# EAGLE schematic mcu_v2.0_sch (EAGLE 9.4.2)
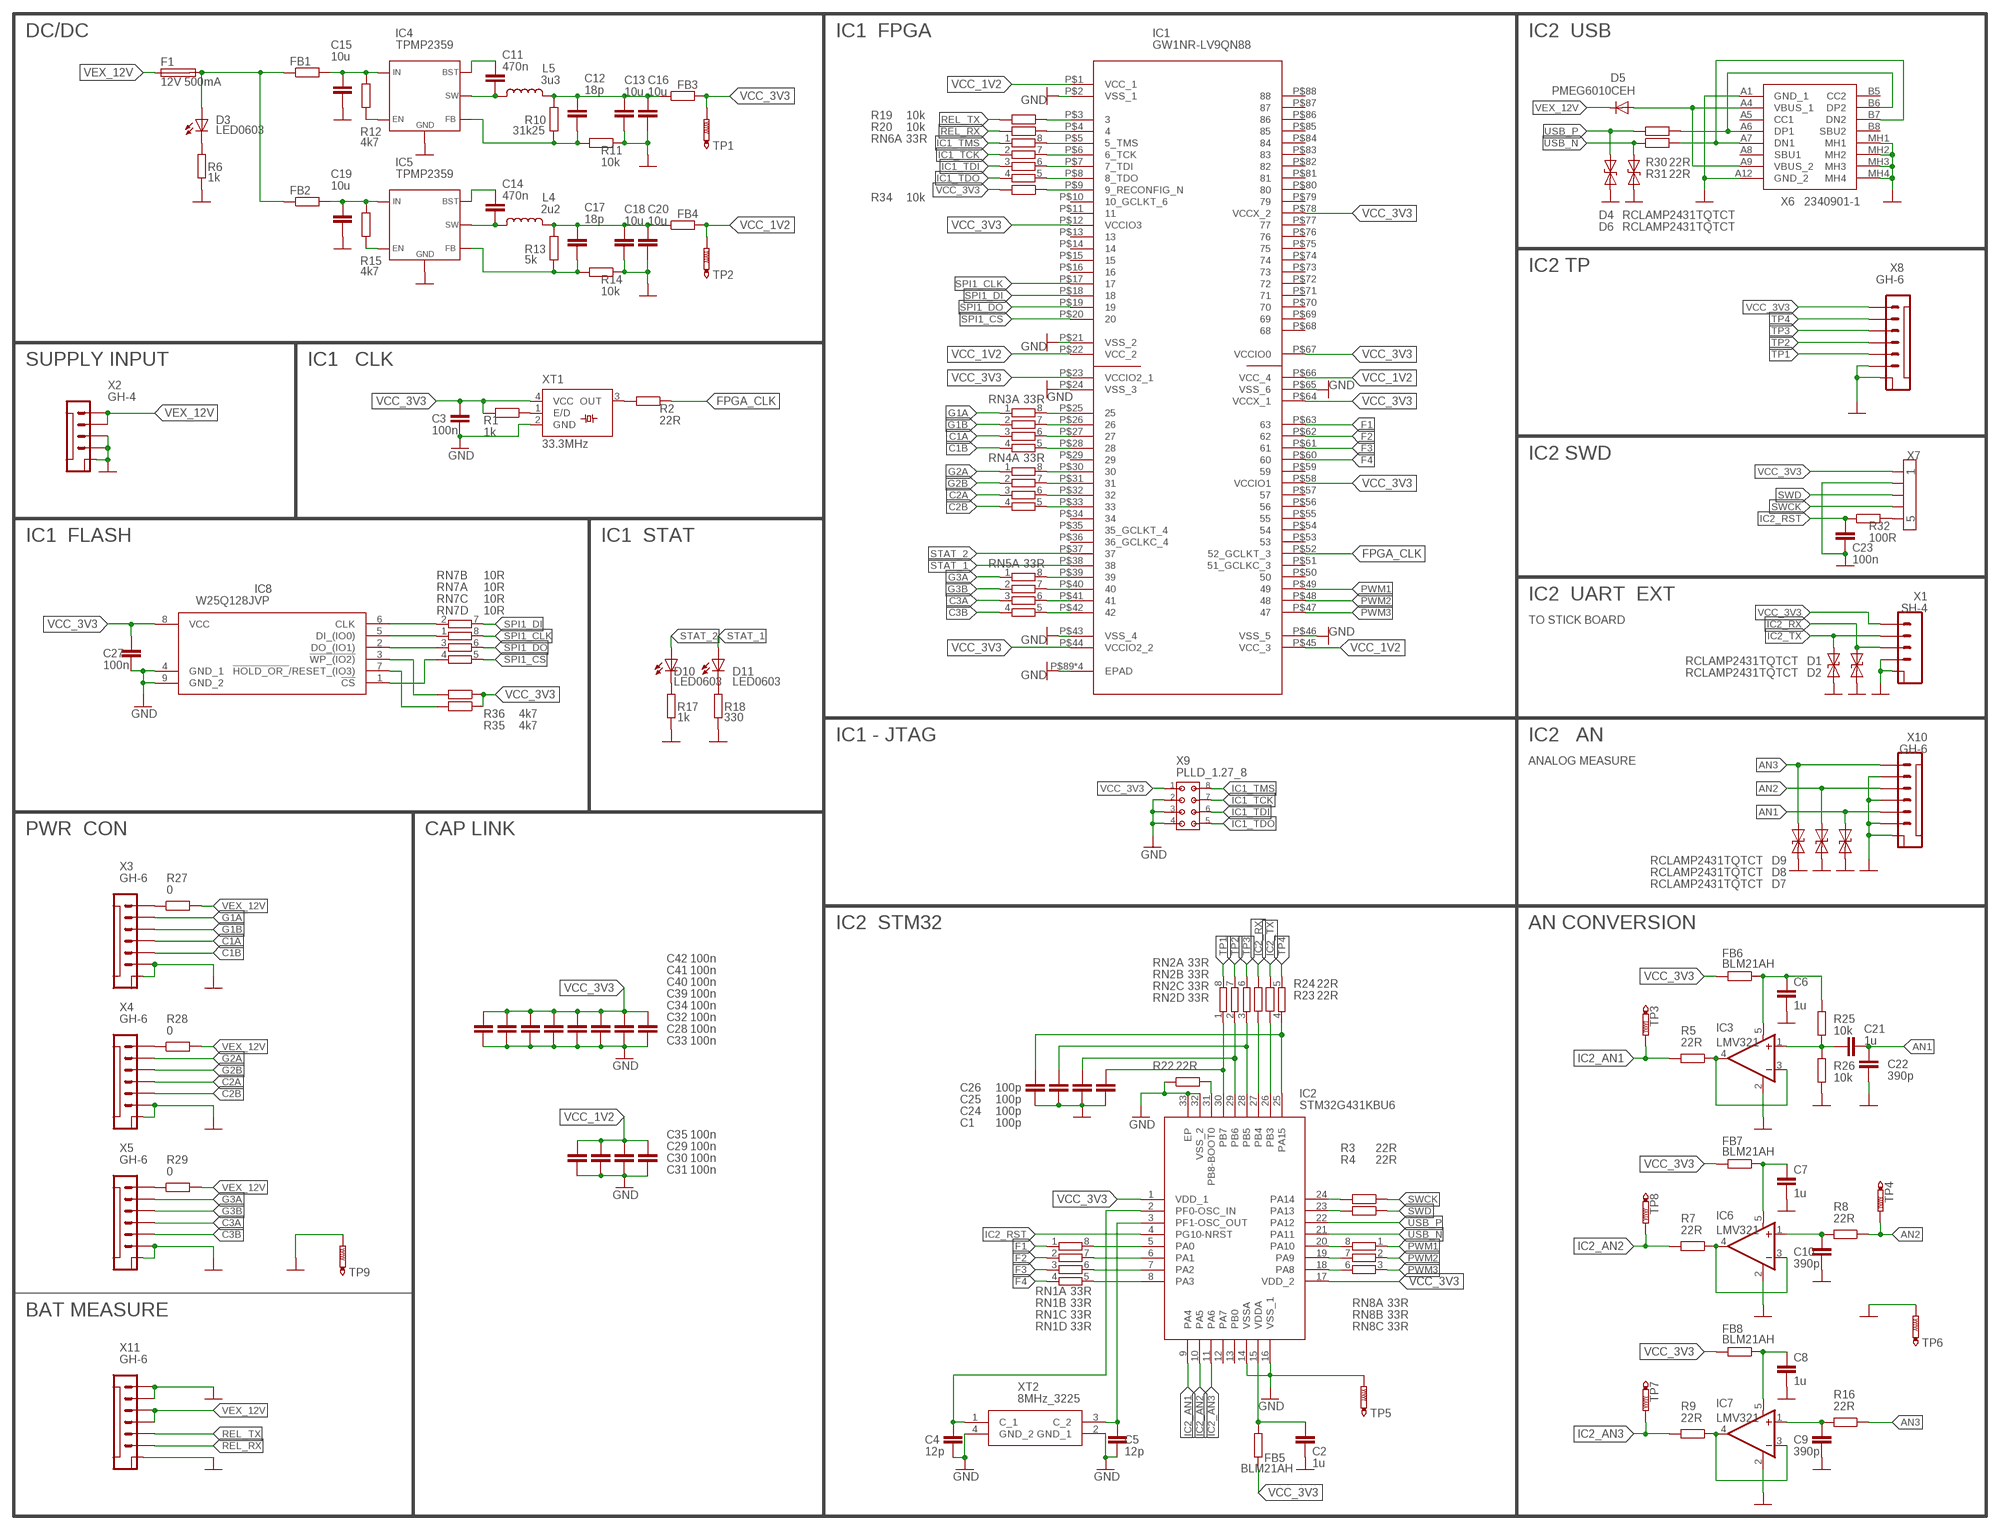
[diagram p0: schematic, sheet 1]

## Parts
C1  100p  C-EUC0402  [C0402]
C2  1u  C-EUC0603  [C0603]
C3  100n  C-EUC0603  [C0603]
C4  12p  C-EUC0603  [C0603]
C5  12p  C-EUC0603  [C0603]
C6  1u  C-EUC0603  [C0603]
C7  1u  C-EUC0603  [C0603]
C8  1u  C-EUC0603  [C0603]
C9  390p  C-EUC0603  [C0603]
C10  390p  C-EUC0603  [C0603]
C11  470n  C-EUC0603  [C0603]
C12  18p  C-EUC0603  [C0603]
C13  10u  C-EUC0805  [C0805]
C14  470n  C-EUC0603  [C0603]
C15  10u  C-EUC0805  [C0805]
C16  10u  C-EUC0805  [C0805]
C17  18p  C-EUC0603  [C0603]
C18  10u  C-EUC0805  [C0805]
C19  10u  C-EUC0805  [C0805]
C20  10u  C-EUC0805  [C0805]
C21  1u  C-EUC0603  [C0603]
C22  390p  C-EUC0603  [C0603]
C23  100n  C-EUC0402  [C0402]
C24  100p  C-EUC0402  [C0402]
C25  100p  C-EUC0402  [C0402]
C26  100p  C-EUC0402  [C0402]
C27  100n  C-EUC0603  [C0603]
C28  100n  C-EUC0603  [C0603]
C29  100n  C-EUC0603  [C0603]
C30  100n  C-EUC0603  [C0603]
C31  100n  C-EUC0603  [C0603]
C32  100n  C-EUC0603  [C0603]
C33  100n  C-EUC0603  [C0603]
C34  100n  C-EUC0603  [C0603]
C35  100n  C-EUC0603  [C0603]
C39  100n  C-EUC0603  [C0603]
C40  100n  C-EUC0603  [C0603]
C41  100n  C-EUC0603  [C0603]
C42  100n  C-EUC0603  [C0603]
D1  RCLAMP2431TQTCT  [RCLAMP2431TQTCT]
D2  RCLAMP2431TQTCT  [RCLAMP2431TQTCT]
D3  LED0603  [SML0603]
D4  RCLAMP2431TQTCT  [RCLAMP2431TQTCT]
D5  PMEG6010CEH  [SOD123]
D6  RCLAMP2431TQTCT  [RCLAMP2431TQTCT]
D7  RCLAMP2431TQTCT  [RCLAMP2431TQTCT]
D8  RCLAMP2431TQTCT  [RCLAMP2431TQTCT]
D9  RCLAMP2431TQTCT  [RCLAMP2431TQTCT]
D10  LED0603  [SML0603]
D11  LED0603  [SML0603]
F1  12V 500mA  MF-MSMF  [MF-MSMF050]
FB1  R-EU_R0805  [R0805]
FB2  R-EU_R0805  [R0805]
FB3  R-EU_R0805  [R0805]
FB4  R-EU_R0805  [R0805]
FB5  BLM21AH  R-EU_R0805  [R0805]
FB6  BLM21AH  R-EU_R0805  [R0805]
FB7  BLM21AH  R-EU_R0805  [R0805]
FB8  BLM21AH  R-EU_R0805  [R0805]
IC1  GW1NR-LV9QN88  [QFN88]
IC2  STM32G431KBU6  [QFN50P500X500X60-33N]
IC3  LMV321  [SOT23-5]
IC4  TPMP2359  MP2359  [SOT-23-6]
IC5  TPMP2359  MP2359  [SOT-23-6]
IC6  LMV321  [SOT23-5]
IC7  LMV321  [SOT23-5]
IC8  W25Q128JVP  W25Q128JVPIQWSON-8(5X6)  [WSON-8(5X6)]
L4  2u2  SRN3015  [SRN3015]
L5  3u3  SRN3015  [SRN3015]
R1  1k  R-EU_R0603  [R0603]
R2  22R  R-EU_R0603  [R0603]
R3  22R  R-EU_R0402  [R0402]
R4  22R  R-EU_R0402  [R0402]
R5  22R  R-EU_R0603  [R0603]
R6  1k  R-EU_R0603  [R0603]
R7  22R  R-EU_R0603  [R0603]
R8  22R  R-EU_R0603  [R0603]
R9  22R  R-EU_R0603  [R0603]
R10  31k25  R-EU_R0603  [R0603]
R11  10k  R-EU_R0402  [R0402]
R12  4k7  R-EU_R0402  [R0402]
R13  5k  R-EU_R0603  [R0603]
R14  10k  R-EU_R0402  [R0402]
R15  4k7  R-EU_R0402  [R0402]
R16  22R  R-EU_R0603  [R0603]
R17  1k  R-EU_R0603  [R0603]
R18  330  R-EU_R0603  [R0603]
R19  10k  R-EU_R0402  [R0402]
R20  10k  R-EU_R0402  [R0402]
R22  22R  R-EU_R0402  [R0402]
R23  22R  R-EU_R0603  [R0603]
R24  22R  R-EU_R0603  [R0603]
R25  10k  R-EU_R0603  [R0603]
R26  10k  R-EU_R0603  [R0603]
R27  0  R-EU_R1206  [R1206]
R28  0  R-EU_R1206  [R1206]
R29  0  R-EU_R1206  [R1206]
R30  22R  R-EU_R0603  [R0603]
R31  22R  R-EU_R0603  [R0603]
R32  100R  R-EU_R0402  [R0402]
R34  10k  R-EU_R0603  [R0603]
R35  4k7  R-EU_R0603  [R0603]
R36  4k7  R-EU_R0603  [R0603]
RN1  33R  4R-N0603-ARC  [0603-ARC]
RN2  33R  4R-N0603-ARC  [0603-ARC]
RN3  33R  4R-N0603-ARC  [0603-ARC]
RN4  33R  4R-N0603-ARC  [0603-ARC]
RN5  33R  4R-N0603-ARC  [0603-ARC]
RN6  33R  4R-N0603-ARC  [0603-ARC]
RN7  10R  4R-N0603-ARC  [0603-ARC]
RN8  33R  4R-N0603-ARC  [0603-ARC]
TP1  PTR1B1,27  [B1,27]
TP2  PTR1B1,27  [B1,27]
TP3  PTR1B1,27  [B1,27]
TP4  PTR1B1,27  [B1,27]
TP5  PTR1B1,27  [B1,27]
TP6  PTR1B1,27  [B1,27]
TP7  PTR1B1,27  [B1,27]
TP8  PTR1B1,27  [B1,27]
TP9  PTR1B1,27  [B1,27]
X1  SH-4  [SH-4]
X2  GH-4  [GH-4-H]
X3  GH-6  [GH-6]
X4  GH-6  [GH-6]
X5  GH-6  [GH-6]
X6  2340901-1  [23409011]
X7  PIN_HEADER_1.27_5  [PIN_HEADER_1.27_5]
X8  GH-6  [GH-6]
X9  PLLD_1.27_8  [PLD_1.27_8]
X10  GH-6  [GH-6]
X11  GH-6  [GH-6]
XT1  33.3MHz  LFXTAL  [3.2X2.5MM]
XT2  8MHz_3225  CRYSTAL_3225  [3.2X2.5MM]

## Nets
1: C6.1 FB6.1 IC3.5(V+) R25.1
2: C7.1 FB7.1 IC6.5(V+)
3: C8.1 FB8.1 IC7.5(V+)
AN1: C21.2 C22.1 D7.1(A) X10.P$5
AN2: D8.1(A) R8.1 TP4.TP X10.P$3
AN3: D9.1(A) R16.1 X10.P$1
C1A: RN3.3 X3.P$4
C1B: RN3.4 X3.P$5
C2A: RN4.3 X4.P$4
C2B: RN4.4 X4.P$5
C3A: RN5.3 X5.P$4
C3B: RN5.4 X5.P$5
F1: IC1.P$63 RN1.1
F2: IC1.P$62 RN1.2
F3: IC1.P$61 RN1.3
F4: IC1.P$60 RN1.4
FPGA_CLK: IC1.P$52(52_GCLKT_3) R2.1
G1A: RN3.1 X3.P$2
G1B: RN3.2 X3.P$3
G2A: RN4.1 X4.P$2
G2B: RN4.2 X4.P$3
G3A: RN5.1 X5.P$2
G3B: RN5.2 X5.P$3
GND: C1.1 C2.2 C3.2 C4.2 C5.2 C6.2 C7.2 C8.2 C9.2 C10.2 C13.2 C15.2 C16.2 C18.2 C19.2 C20.2 C22.2 C23.1 C24.1 C25.1 C26.1 C27.2 C28.2 C29.2 C30.2 C31.2 C32.2 C33.2 C34.2 C35.2 C39.2 C40.2 C41.2 C42.2 D1.2(A1) D2.2(A1) D4.2(A1) D6.2(A1) D7.2(A1) D8.2(A1) D9.2(A1) IC1.P$2(VSS_1) IC1.P$21(VSS_2) IC1.P$24(VSS_3) IC1.P$43(VSS_4) IC1.P$46(VSS_5) IC1.P$65(VSS_6) IC1.P$89(EPAD) IC1.P$90(EPAD) IC1.P$91(EPAD) IC1.P$92(EPAD) IC2.14(VSSA) IC2.16(VSS_1) IC2.32(VSS_2) IC2.33(EP) IC3.2(V-) IC4.2(GND) IC5.2(GND) IC6.2(V-) IC7.2(V-) IC8.4(GND_1) IC8.9(GND_2) R6.1 R11.1 R14.1 R17.1 R18.1 R22.1 R26.2 TP5.TP TP6.TP TP9.TP X1.G1(G) X1.G2(G) X1.P$4 X2.3 X2.4 X2.P$7(G) X2.P$8(G) X3.P$6 X3.P$7(G) X3.P$8(G) X4.P$6 X4.P$7(G) X4.P$8(G) X5.P$6 X5.P$7(G) X5.P$8(G) X6.A1(GND_1) X6.A12(GND_2) X6.MH1 X6.MH2 X6.MH3 X6.MH4 X7.P$2 X8.P$6 X8.P$7(G) X8.P$8(G) X9.1 X9.7 X9.8 X10.P$2 X10.P$4 X10.P$6 X10.P$7(G) X10.P$8(G) X11.P$1 X11.P$2 X11.P$7(G) X11.P$8(G) XT1.2(GND) XT2.2(GND_1) XT2.4(GND_2)
IC1_TCK: RN6.2 X9.4
IC1_TDI: RN6.3 X9.3
IC1_TDO: RN6.4 X9.6
IC1_TMS: RN6.1 X9.5
IC2_AN1: IC2.9(PA4) R5.2 TP3.TP
IC2_AN2: IC2.10(PA5) R7.2 TP8.TP
IC2_AN3: IC2.11(PA6) R9.2 TP7.TP
IC2_RST: C23.2 IC2.4(PG10-NRST) R32.1
IC2_RX: D1.1(A) R24.2 X1.P$3
IC2_TX: D2.1(A) R23.2 X1.P$2
N$1: C2.1 FB5.2 IC2.15(VDDA)
N$2: R1.1 XT1.1(E/D)
N$3: R2.2 XT1.3(OUT)
N$4: C11.1 IC4.1(BST)
N$5: C4.1 IC2.2(PF0-OSC_IN) XT2.1(C_1)
N$6: C5.1 IC2.3(PF1-OSC_OUT) XT2.3(C_2)
N$7: IC2.24(PA14) R3.2
N$8: C11.2 IC4.6(SW) L5.P$1
N$9: IC2.23(PA13) R4.2
N$10: IC2.8(PA3) RN1.5
N$11: C14.1 IC5.1(BST)
N$12: IC2.7(PA2) RN1.6
N$13: IC4.4(EN) R12.1
N$14: C12.2 IC4.3(FB) R10.1 R11.2
N$15: C15.1 FB1.2 IC4.5(IN) R12.2
N$16: C14.2 IC5.6(SW) L4.P$1
N$17: C17.2 IC5.3(FB) R13.1 R14.2
N$18: IC5.4(EN) R15.1
N$19: C19.1 FB2.2 IC5.5(IN) R15.2
N$20: C12.1 C13.1 C16.1 FB3.1 L5.P$2 R10.2
N$21: C17.1 C18.1 C20.1 FB4.1 L4.P$2 R13.2
N$22: IC2.6(PA1) RN1.7
N$23: IC2.5(PA0) RN1.8
N$24: IC3.3(-IN) IC3.4(OUT) R5.1
N$25: C21.1 IC3.1(+IN) R25.2 R26.1
N$26: IC6.3(-IN) IC6.4(OUT) R7.1
N$27: C10.1 IC6.1(+IN) R8.2
N$28: IC7.3(-IN) IC7.4(OUT) R9.1
N$29: C9.1 IC7.1(+IN) R16.2
N$30: IC8.6(CLK) RN7.2
N$31: IC8.5(DI_(IO0)) RN7.1
N$32: IC2.20(PA10) RN8.8
N$33: IC2.19(PA9) RN8.7
N$34: IC2.18(PA8) RN8.6
N$35: IC2.31(PB8-BOOT0) R22.2
N$36: IC2.27(PB4) R24.1
N$37: IC2.26(PB3) R23.1
N$38: C1.2 IC2.30(PB7) RN2.1
N$39: C24.2 IC2.29(PB6) RN2.2
N$40: C25.2 IC2.28(PB5) RN2.3
N$41: D3.C R6.2
N$42: IC1.P$25 RN3.8
N$43: IC1.P$26 RN3.7
N$44: IC1.P$27 RN3.6
N$45: IC1.P$28 RN3.5
N$46: IC1.P$30 RN4.8
N$47: IC1.P$31 RN4.7
N$48: IC1.P$32 RN4.6
N$49: IC1.P$33 RN4.5
N$50: IC1.P$39 RN5.8
N$51: IC1.P$40 RN5.7
N$52: IC1.P$41 RN5.6
N$53: IC1.P$42 RN5.5
N$54: R27.1 X3.P$1
N$55: R32.2 X7.P$5
N$56: D5.A X6.A4(VBUS_1) X6.A9(VBUS_2)
N$57: IC1.P$3 R19.1
N$58: R30.2 X6.A6(DP1) X6.B6(DP2)
N$59: R28.1 X4.P$1
N$60: R31.2 X6.A7(DN1) X6.B7(DN2)
N$61: C26.2 IC2.25(PA15) RN2.4
N$62: IC1.P$5(5_TMS) RN6.8
N$63: IC1.P$6(6_TCK) RN6.7
N$64: R29.1 X5.P$1
N$65: IC1.P$7(7_TDI) RN6.6
N$66: IC1.P$8(8_TDO) RN6.5
N$67: IC1.P$9(9_RECONFIG_N) R34.1
N$68: D10.C R17.2
N$69: D11.C R18.2
N$70: IC8.2(DO_(IO1)) RN7.3
N$71: IC8.1(!CS) RN7.4
N$72: IC8.7(!HOLD_OR_!/RESET_(IO3)) R36.2
N$73: IC8.3(!WP_(IO2)) R35.2
N$74: IC1.P$4 R20.1
PWM1: IC1.P$49 RN8.1
PWM2: IC1.P$48 RN8.2
PWM3: IC1.P$47 RN8.3
REL_RX: R20.2 X11.P$6
REL_TX: R19.2 X11.P$5
SPI1_CLK: IC1.P$17 RN7.8
SPI1_CS: IC1.P$20 RN7.5
SPI1_DI: IC1.P$18 RN7.7
SPI1_DO: IC1.P$19 RN7.6
STAT_1: D11.A IC1.P$38
STAT_2: D10.A IC1.P$37
SWCK: R3.1 X7.P$4
SWD: R4.1 X7.P$3
TP1: RN2.8 X8.P$5
TP2: RN2.7 X8.P$4
TP3: RN2.6 X8.P$3
TP4: RN2.5 X8.P$2
USB_N [differential]: D4.1(A) IC2.21(PA11) R31.1
USB_P [differential]: D6.1(A) IC2.22(PA12) R30.1
VCC_1V2: C29.1 C30.1 C31.1 C35.1 FB4.2 IC1.P$1(VCC_1) IC1.P$22(VCC_2) IC1.P$45(VCC_3) IC1.P$66(VCC_4) TP2.TP
VCC_3V3: C3.1 C27.1 C28.1 C32.1 C33.1 C34.1 C39.1 C40.1 C41.1 C42.1 FB3.2 FB5.1 FB6.2 FB7.2 FB8.2 IC1.P$12(VCCIO3) IC1.P$23(VCCIO2_1) IC1.P$44(VCCIO2_2) IC1.P$58(VCCIO1) IC1.P$64(VCCX_1) IC1.P$67(VCCIO0) IC1.P$78(VCCX_2) IC2.1(VDD_1) IC2.17(VDD_2) IC8.8(VCC) R1.2 R34.2 R35.1 R36.1 TP1.TP X1.P$1 X7.P$1 X8.P$1 X9.2 XT1.4(VCC)
VEX_12V: D5.C F1.1 R27.2 R28.2 R29.2 X2.1 X2.2 X11.P$3 X11.P$4
VIN_12V: D3.A F1.2 FB1.1 FB2.1
Unconnected: IC1.P$10(10_GCLKT_6) IC1.P$11 IC1.P$13 IC1.P$14 IC1.P$15 IC1.P$16 IC1.P$29 IC1.P$34 IC1.P$35(35_GCLKT_4) IC1.P$36(36_GCLKC_4) IC1.P$50 IC1.P$51(51_GCLKC_3) IC1.P$53 IC1.P$54 IC1.P$55 IC1.P$56 IC1.P$57 IC1.P$59 IC1.P$68 IC1.P$69 IC1.P$70 IC1.P$71 IC1.P$72 IC1.P$73 IC1.P$74 IC1.P$75 IC1.P$76 IC1.P$77 IC1.P$79 IC1.P$80 IC1.P$81 IC1.P$82 IC1.P$83 IC1.P$84 IC1.P$85 IC1.P$86 IC1.P$87 IC1.P$88 IC2.12(PA7) IC2.13(PB0) RN8.4 RN8.5 X6.A5(CC1) X6.A8(SBU1) X6.B5(CC2) X6.B8(SBU2)

## Notes on the sheet
- DC/DC | IC1  FPGA | IC2  USB
- IC2 TP
- SUPPLY INPUT | IC1   CLK
- IC2 SWD
- IC1  FLASH | IC1  STAT
- IC2  UART  EXT
- TO STICK BOARD
- IC1 - JTAG | IC2   AN
- ANALOG MEASURE
- PWR  CON | CAP LINK
- IC2  STM32 | AN CONVERSION
- BAT MEASURE

## Library data of the parts
C1-C35 C39-C42 = with-caps:C-EU: CAPACITOR, European symbol
D1 D2 D4 D6-D9 = with-diodes:RCLAMP2431TQTCT: ESD Suppressors / TVS Diodes RAILCLAMP 1-Line 24V 0.35pF SLP1006P2T Source: Datasheet <https://www.arrow.com/en/products/rclamp2431tqtct/semtech>; DESCRIPTION: ESD Suppressors / TVS Diodes RAILCLAMP 1-Line 24V 0.35pF SLP1006P2T; HEIGHT: 0.43mm; MANUFACTURER_NAME: SEMTECH; MANUFACTURER_PART_NUMBER: RCLAMP2431TQTCT; MOUSER_PART_NUMBER: 947-RCLAMP2431TQTCT; MOUSER_PRICE-STOCK: https://www.mouser.co.uk/ProductDetail/Semtech/RCLAMP2431TQTCT?qs=rBWM4%252BvDhIcwawbQQ1T6kQ%3D%3D
D3 D10 D11 = with-leds:LED: SMD LED Diode
D5 = with-diodes:PMEG6010CEH: Shottky diode Forward current: IF ≤ 1 A Reverse voltage: VR ≤ 60 V Forward voltage = 660mV Capacitane = 72pF
F1 = with-FUSE:MF-MSMF: Bourns Chip Fuse
FB1-FB8 R1-R20 R22-R32 R34-R36 = with-resistors:R-EU_: RESISTOR, European symbol; SPICEPREFIX: R
IC1 = with-ICs:GW1NR-LV9QN88: GOWIN 9k LUT with SRAM Packages QFN-88P 10x10mm 0.4mm https://www.gowinsemi.com/en/product/detail/46/
IC2 = with-ICs:STM32G431KBU6: STMICROELECTRONICS - STM32G431KBU6 - MCU, 32BIT, 170MHZ, UFQFPN-32 Source: Datasheet <https://www.st.com/resource/en/datasheet/stm32g431kb.pdf>; ARROW_PART_NUMBER: STM32G431KBU6; ARROW_PRICE-STOCK: https://www.arrow.com/en/products/stm32g431kbu6/stmicroelectronics?region=nac; DESCRIPTION: STMICROELECTRONICS - STM32G431KBU6 - MCU, 32BIT, 170MHZ, UFQFPN-32; HEIGHT: 0.6mm; MANUFACTURER_NAME: STMicroelectronics; MANUFACTURER_PART_NUMBER: STM32G431KBU6; MOUSER_PART_NUMBER: 511-STM32G431KBU6; MOUSER_PRICE-STOCK: https://www.mouser.co.uk/ProductDetail/STMicroelectronics/STM32G431KBU6?qs=T3oQrply3y%2Frk9w4R%2FCLxg%3D%3D
IC3 IC6 IC7 = with-ICs:LMV321: Op Amp 2,7 - 6V Rail to Rail Gain bandwidth product (1 MHz) Low supply current (145 µA)
IC4 IC5 = with-ICs:MP2359: Step-Down Converter in a TSOT23-6 1.2A, 24V, 1.4MHz
IC8 = with-ICs:W25Q128JVPIQ: 128M-bit Serial Flash Memory with uniform 4KB sectors and Dual/Quad SPI Source: Datasheet <https://www.winbond.com/hq/search-resource-file.jsp?partNo=W25Q128JVPIQ&type=datasheet>; ARROW_PART_NUMBER: W25Q128JVPIQ; ARROW_PRICE-STOCK: https://www.arrow.com/en/products/w25q128jvpiq/winbond-electronics?region=nac; DESCRIPTION: 128M-bit Serial Flash Memory with uniform 4KB sectors and Dual/Quad SPI; HEIGHT: 0.8mm; MANUFACTURER_NAME: Winbond; MANUFACTURER_PART_NUMBER: W25Q128JVPIQ; MOUSER_PART_NUMBER: 454-W25Q128JVPIQ; MOUSER_PRICE-STOCK: https://www.mouser.co.uk/ProductDetail/Winbond/W25Q128JVPIQ?qs=qSfuJ%252Bfl%2Fd676hAD%252B1JSfw%3D%3D
L4 L5 = with-inductors:SRN3015: Semishilded Inductor 3 x 3 x 1.5 mm
RN1-RN8 = with-resistors:4R-N: Array Chip Resistor Source: RS Component / Phycomp; OC_FARNELL: unknown; OC_NEWARK: unknown
TP1-TP9 = testpad:PTR1: TEST PIN
X1 = with-con:SH-4
X2 = with-con:GH-4: JST connector with lock pitch=1.25mm 50V 1A rated; PART-NUM: SM04B-GHS-TB
X3-X5 X8 X10 X11 = with-con:GH-6: JST connector with locker 50V 1A; PART-NUM: SM06B-GHS-TB
X6 = with-con:2340901-1: USB Type C 2.0 Conn Rec Mid-Mount One Ro Source: Datasheet <https://www.te.com/commerce/DocumentDelivery/DDEController?Action=showdoc&DocId=Customer Drawing2340901ApdfEnglishENG_CD_2340901_A.pdf2340901-1>; ARROW_PART_NUMBER: 2340901-1; ARROW_PRICE-STOCK: https://www.arrow.com/en/products/2340901-1/te-connectivity?region=nac; DESCRIPTION: USB Type C 2.0 Conn Rec Mid-Mount One Ro; HEIGHT: 3.36mm; MANUFACTURER_NAME: TE Connectivity; MANUFACTURER_PART_NUMBER: 2340901-1; MOUSER_PART_NUMBER: 571-2340901-1; MOUSER_PRICE-STOCK: https://www.mouser.co.uk/ProductDetail/TE-Connectivity/2340901-1?qs=eP2BKZSCXI7BSVkMMiSx2A%3D%3D
X7 = with-con:PIN_HEADER_1.27_5: grid = 1.27
X9 = with-con:PLLD_1.27_8
XT1 = with-crystals:LFXTAL
XT2 = with-crystals:CRYSTAL_3225

## Net classes
1 differential: width 0.4 mm, drill 0.2 mm